# Altium schematic sheet main.SchDoc
size A; SheetNumber: 1; SheetTotal: 3
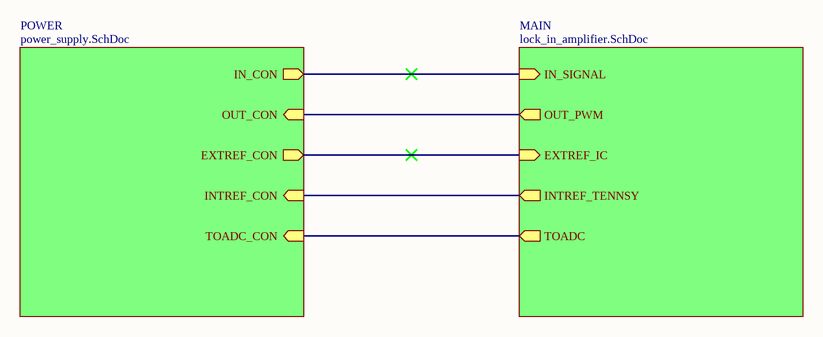
[diagram p0: main.SchDoc]

## Sub-sheets
MAIN = lock_in_amplifier.SchDoc: TOADC (out), INTREF_TENNSY (out), EXTREF_IC (in), OUT_PWM (out), IN_SIGNAL (in)
POWER = power_supply.SchDoc: INTREF_CON (in), EXTREF_CON (out), OUT_CON (in), IN_CON (out), TOADC_CON (in)

## Nets
(unnamed): sheet POWER/INTREF_CON, sheet MAIN/INTREF_TENNSY
(unnamed): sheet POWER/EXTREF_CON, sheet MAIN/EXTREF_IC
(unnamed): sheet POWER/OUT_CON, sheet MAIN/OUT_PWM
(unnamed): sheet POWER/IN_CON, sheet MAIN/IN_SIGNAL
(unnamed): sheet POWER/TOADC_CON, sheet MAIN/TOADC